# EAGLE design Brain Conn Disconnect (12) (EAGLE 9.6.2)
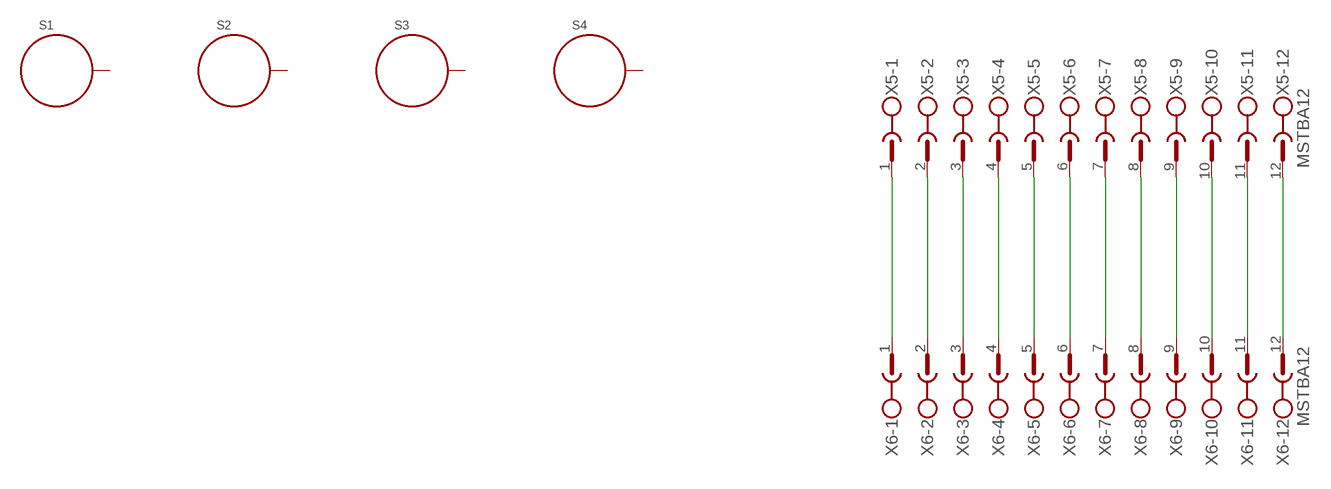
[diagram p0: schematic, sheet 1]

## Parts
S1  STANDOFF_ELECTRICAL144  [STANDOFF_ELECTRICAL_144MILL_NORMAL_SCREW]
S2  STANDOFF_ELECTRICAL144  [STANDOFF_ELECTRICAL_144MILL_NORMAL_SCREW]
S3  STANDOFF_ELECTRICAL144  [STANDOFF_ELECTRICAL_144MILL_NORMAL_SCREW]
S4  STANDOFF_ELECTRICAL144  [STANDOFF_ELECTRICAL_144MILL_NORMAL_SCREW]
X5  MSTBA12  [MSTBA12]
X6  MSTBA12  [MSTBA12]

## Nets
N$1: X5.1 X6.1
N$2: X5.2 X6.2
N$3: X5.3 X6.3
N$4: X5.4 X6.4
N$5: X5.5 X6.5
N$6: X5.6 X6.6
N$7: X5.7 X6.7
N$8: X5.8 X6.8
N$9: X5.9 X6.9
N$10: X5.10 X6.10
N$11: X5.11 X6.11
N$12: X5.12 X6.12
Unconnected: S1.P1 S2.P1 S3.P1 S4.P1

## Library data of the parts
S1-S4 = th_libraries:STANDOFF_ELECTRICAL: A standoff intended to be an electrically connected point. Pad size and stop size allow for a #8 Phillips pan screw head to make a solid connection to the board. Added 144mill drill hole that fits my normal wood screw
X5 X6 = con-phoenix-508:MSTBA12: PHOENIX; MPN: 1757349; OC_FARNELL: 3705250; OC_NEWARK: 71C4169

## Board
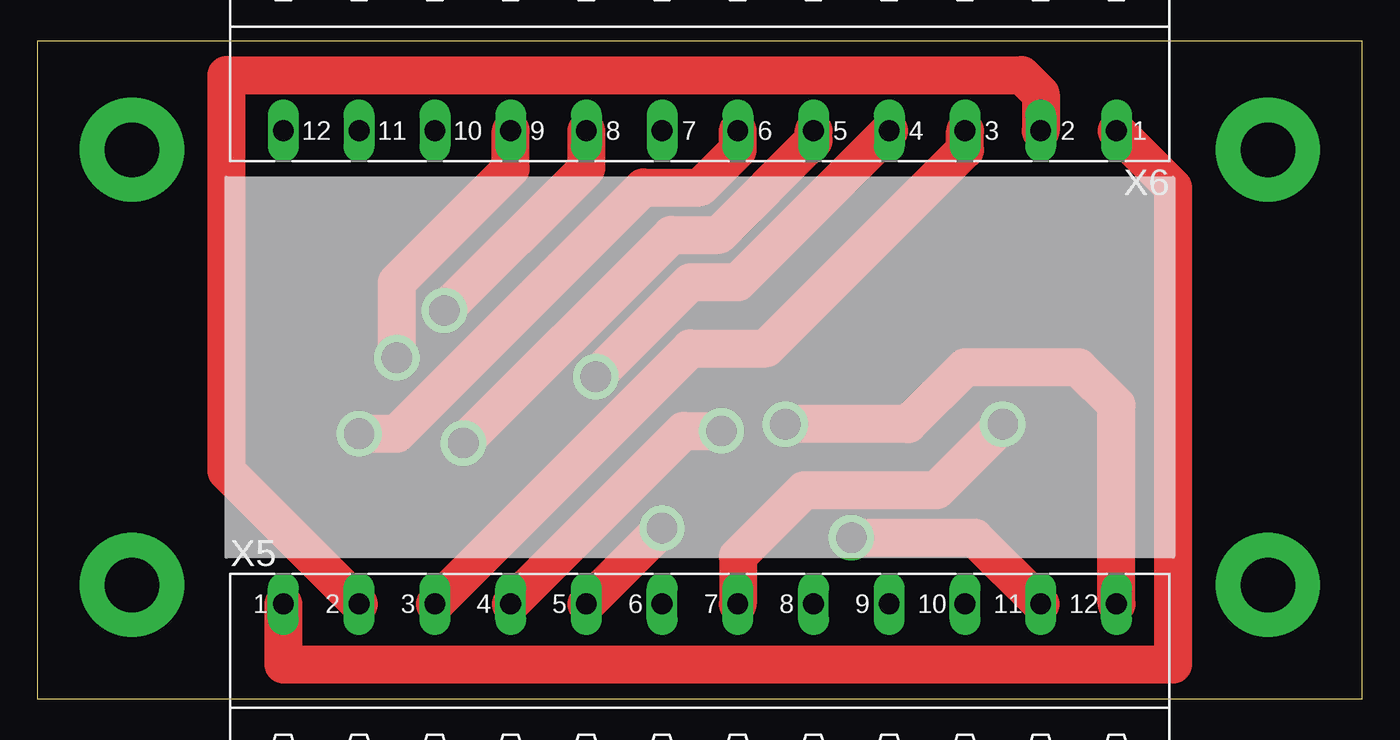
[diagram p1: board, top side]
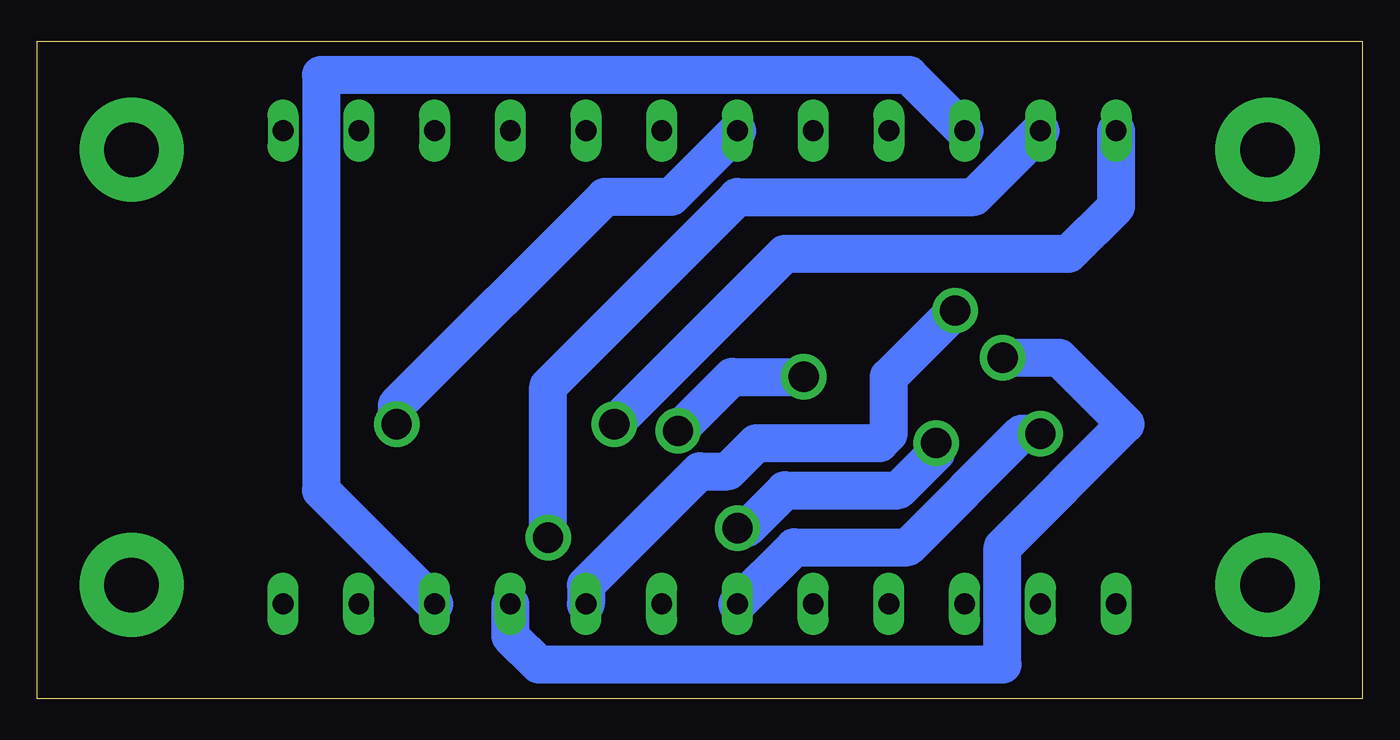
[diagram p2: board, bottom side, seen from below]

Size 88.88 x 44.12 mm. Coordinates in mm from the lower left corner, seen from the top.
Outline: 0,0 88.88,0 88.88,44.12 0,44.12 0,0
Copper layers (1*16): Top 0.035mm / dielectric 1.5mm / Bottom 0.035mm
Design rules "default": minimum track width 6mil, minimum drill 0.35mm, track to track 6mil, track to pad 6mil, pad to pad 6mil, via to via 6mil, smd to smd 6mil, copper to edge 40mil, drill to drill 6mil, minimum pad ring 10mil, minimum via ring 8mil, stop-mask expansion 4mil, vias tented up to drill 0mil, thermal gap 10mil

### Footprints (pad centres in the part's own frame; a part is rotated, then mirrored left to right if it is on the bottom)
STANDOFF_ELECTRICAL_144MILL_NORMAL_SCREW = drill 3.658 pad 6.985: P1 0,0
MSTBA12 = drill 1.397 long: 1 -27.94,5.08; 2 -22.86,5.08; 3 -17.78,5.08; 4 -12.7,5.08; 5 -7.62,5.08; 6 -2.54,5.08; 7 2.54,5.08; 8 7.62,5.08; 9 12.7,5.08; 10 17.78,5.08; 11 22.86,5.08; 12 27.94,5.08

### Placement (x,y rotation side)
S1  6.35,7.62 0 top
S2  6.35,36.83 0 top
S3  82.55,7.62 0 top
S4  82.55,36.83 0 top
X5  44.45,1.27 0 top
X6  44.45,43.18 180 top

### Tracks (layer width: path | path; a pad name or v marks a point on that pad's centre or on a via)
N$1
  Top 2.54: X5.1 16.51,2.29 76.2,2.29 76.2,34.29 X6.1
N$2
  Top 2.54: X5.2 12.7,15.24 12.7,41.83 66.04,41.83 67.31,40.56 X6.2
N$3
  Top 2.54: X5.3 43.81,23.5 48.9,23.5 62.23,36.83 X6.3
N$4  (via drill 2.03 pad 0.55)
  Top 2.54: v37.46,21.59 43.81,27.94 46.99,27.94 X6.4 | X5.4 43.36,17.96 v45.9,17.96
  Bottom 2.54: v45.9,17.96 42.27,21.59 v37.46,21.59
N$5  (via drill 2.03 pad 0.55)
  Top 2.54: X5.5 v41.91,11.43 | v28.57,17.14 42.54,31.11 45.72,31.11 52.07,37.47 X6.5
  Bottom 2.54: v41.91,11.43 41.27,11.43 38.73,13.97 31.11,13.97 28.57,16.51 v28.57,17.14
N$6  (via drill 2.03 pad 0.55)
  Top 2.54: v21.59,17.78 24.13,17.78 40.64,34.29 44.45,34.29 46.99,36.83 X6.6
  Bottom 2.54: X5.6 38.1,10.16 30.48,10.16 22.86,17.78 v21.59,17.78
N$7  (via drill 2.03 pad 0.55)
  Top 2.54: v64.77,18.41 60.32,13.97 51.43,13.97 46.99,9.53 X5.7
  Bottom 2.54: X6.7 46.35,33.66 50.8,33.66 64.77,19.68 v64.77,18.41
N$8  (via drill 2.03 pad 0.55)
  Top 2.54: X6.8 36.83,35.56 v27.3,26.04
  Bottom 2.54: X5.8 52.07,7.62 44.45,15.24 42.54,15.24 40.64,17.14 32.38,17.14 31.75,17.78 31.75,21.59 v27.3,26.04
N$9  (via drill 2.03 pad 0.55)
  Top 2.54: v24.13,22.86 24.13,27.94 31.75,35.56 X6.9
  Bottom 2.54: X5.9 57.15,4.19 55.24,2.29 24.13,2.29 24.13,10.16 15.87,18.41 20.32,22.86 v24.13,22.86
N$10
  Bottom 2.54: X6.10 30.4,41.83 69.85,41.83 69.85,13.97 X5.10
N$11  (via drill 2.03 pad 0.55)
  Top 2.54: X5.11 62.87,10.79 v54.61,10.79
  Bottom 2.54: v54.61,10.79 54.61,20.95 41.91,33.66 26.03,33.66 X6.11
N$12  (via drill 2.03 pad 0.55)
  Top 2.54: X5.12 72.39,19.68 69.85,22.23 62.23,22.23 58.42,18.41 v50.16,18.41
  Bottom 2.54: v50.16,18.41 38.73,29.84 19.68,29.84 16.51,33.02 X6.12

### Text on the board
tPlace: OMSI Brain Basics / Disconnect Board / 3-22-21 DS